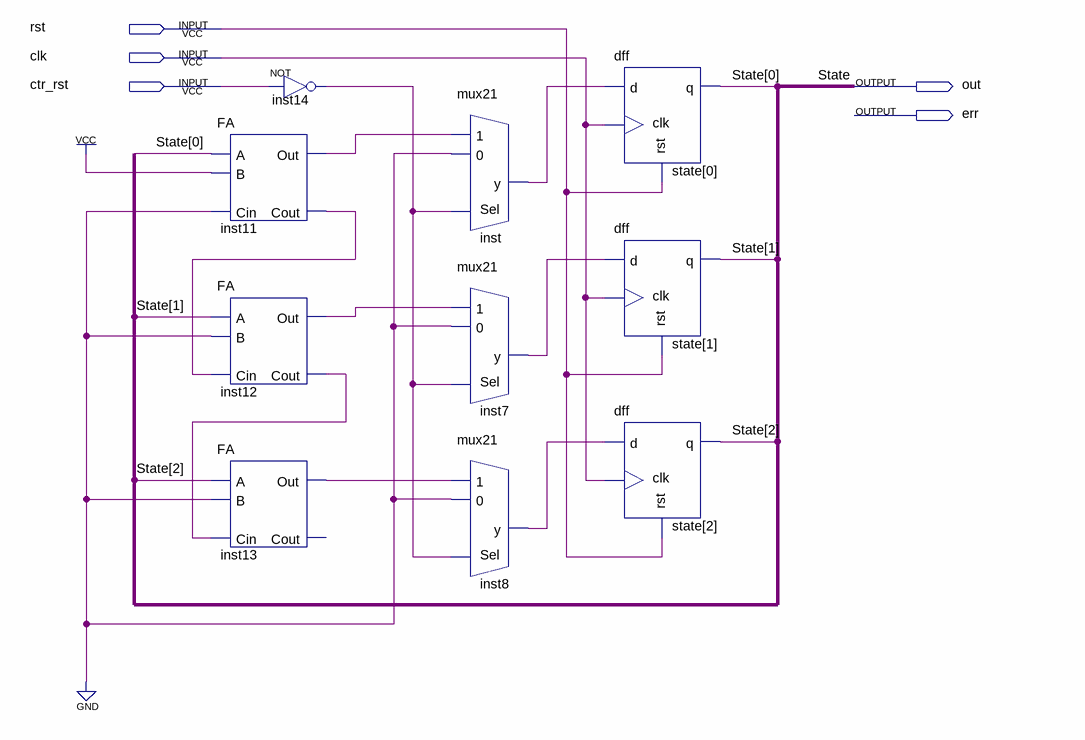
[diagram p0: schematic sheet]
// Quartus schematic hw3_2.bdf as structural Verilog: 10 symbols, 5 pins
module hw3_2 (
  input  rst,
  input  clk,
  input  ctr_rst,
  output out,
  output err
);

  wire inst7_y, inst8_y, inst11_cout, inst11_out, inst12_cout, inst12_out, inst13_out, inst14_out, inst_y;
  wire [2:0] State;

  FA inst11 (.A(State[0]), .B(1'b1), .Cin(1'b0), .Out(inst11_out), .Cout(inst11_cout));
  FA inst12 (.A(State[1]), .B(1'b0), .Cin(inst11_cout), .Out(inst12_out), .Cout(inst12_cout));
  FA inst13 (.A(State[2]), .B(1'b0), .Cin(inst12_cout), .Out(inst13_out));  // open: Cout
  not inst14 (inst14_out, ctr_rst);
  mux21 inst (.Sel(inst14_out), .\0 (1'b0), .\1 (inst11_out), .y(inst_y));
  mux21 inst7 (.Sel(inst14_out), .\0 (1'b0), .\1 (inst12_out), .y(inst7_y));
  mux21 inst8 (.Sel(inst14_out), .\0 (1'b0), .\1 (inst13_out), .y(inst8_y));
  dff \state[0]  (.d(inst_y), .clk(clk), .rst(rst), .q(State[0]));
  dff \state[1]  (.d(inst7_y), .clk(clk), .rst(rst), .q(State[1]));
  dff \state[2]  (.d(inst8_y), .clk(clk), .rst(rst), .q(State[2]));

  // Other names for the same wires on the sheet: State = out
endmodule
